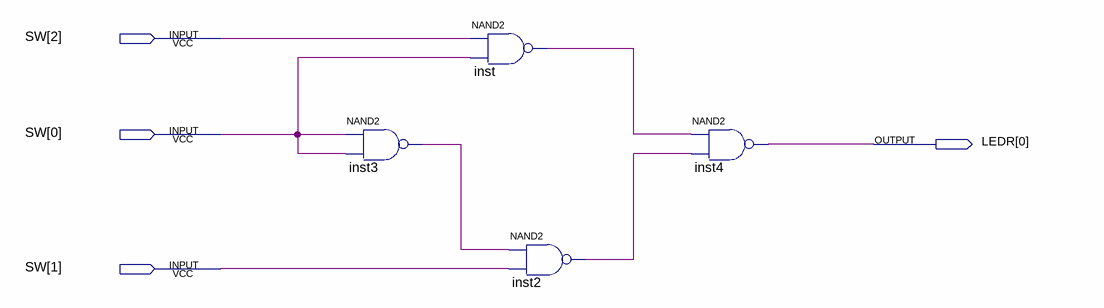
[diagram p0: schematic sheet]
// Quartus schematic mux_2_to_1.bdf as structural Verilog: 4 symbols, 4 pins
module mux_2_to_1 (
  input  [2:0] SW,
  output [0:0] LEDR
);

  wire inst2_out, inst3_out, inst_out;

  nand inst3 (inst3_out, SW[0], SW[0]);
  nand inst (inst_out, SW[2], SW[0]);
  nand inst2 (inst2_out, inst3_out, SW[1]);
  nand inst4 (LEDR[0], inst_out, inst2_out);
endmodule
